# Altium schematic sheet 控制.SchDoc
size A4
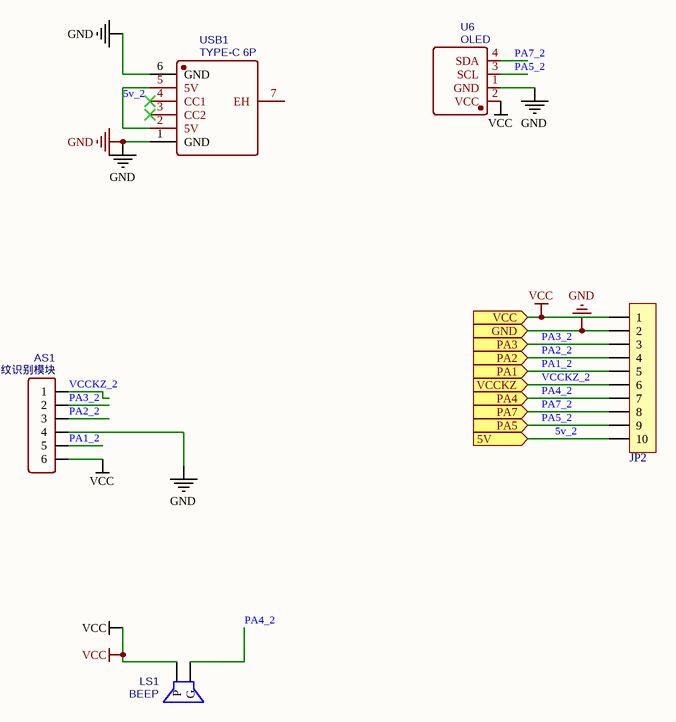
[diagram p0: 控制.SchDoc]

## Parts
AS1  指纹识别模块  [HDR2.54-WI-6P]
JP2  HDR-1X10  [MX 1.25-WI-10P]  (value not drawn)
LS1  BEEP  [BEEP 6.5x12x6]
U6  OLED  [0.96_OLED]
USB1  TYPE-C 6P  [USB-C-SMD_10P-P1.00-L6.8-W8.9]

## Ports
5V (in), GND (in), PA1 (in), PA2 (in), PA3 (in), PA4 (in), PA5 (in), PA7 (in), VCC (in), VCCKZ (in)

## Nets
GND: AS1.4 JP2.2 U6.1(GND) USB1.1(GND) USB1.6(GND) ; port GND
VCC: AS1.6 JP2.1 LS1.1(P) U6.2(VCC) ; port VCC
5v_2: JP2.10 USB1.2(5V) USB1.5(5V) ; port 5V
PA1_2: AS1.5 JP2.5 ; port PA1
PA2_2: AS1.3 JP2.4 ; port PA2
PA3_2: AS1.2 JP2.3 ; port PA3
PA4_2: JP2.7 LS1.2(G) ; port PA4
PA5_2: JP2.9 U6.3(SCL) ; port PA5
PA7_2: JP2.8 U6.4(SDA) ; port PA7
VCCKZ_2: AS1.1 JP2.6 ; port VCCKZ

Not connected (* = marked no-connect by the designer): USB1 3(CC2)* 4(CC1)* 7(EH)

## Library data of the parts
AS1 = 指纹识别模块: Contributor: LCEDA_Lib; BOM_Supplier Part: C190819; BOM_Supplier: LCSC; spicePre: J; spiceSymbolName: HDR-M-2.54_1x6
JP2 = Header 10: 10P接插件; 卖家免费技术支持，联系售后: 唯一出售店铺网址https://shop463601444.taobao.com; 封装库来自淘宝卖家 ID：黄晶宝石: 其他店铺购入均为假冒，请申请退款，本店现金奖励; 优秀评价可免费更新封装库: 联系淘宝ID：黄晶宝石，获取更新版封装库; BOM名称: 10P接插件
LS1 = BEEP: Contributor: nibo; spicePre: L; spiceSymbolName: BEEP
U6 = OLED: Contributor: Sheikah; spicePre: U; spiceSymbolName: OLED
USB1 = TYPE-C 6P: BOM_Manufacturer: SHOU HAN; Contributor: youzige; BOM_Supplier: LCSC; BOM_Supplier Part: C456012; BOM_Manufacturer Part: TYPE-C 6P; spicePre: U; spiceSymbolName: TYPE-C 6P